# Altium schematic sheet sensors.SchDoc
size A4; SheetNumber: 4; SheetTotal: 9
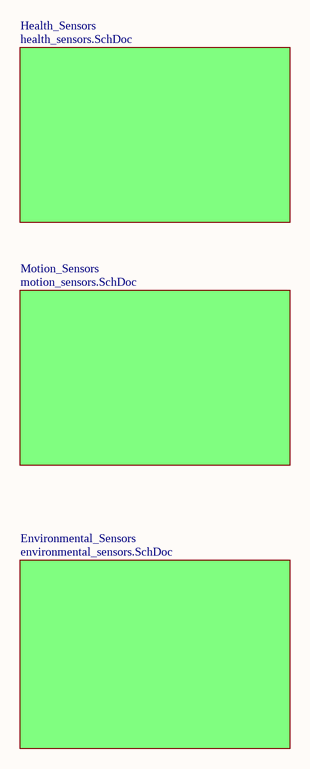
[diagram p0: sensors.SchDoc]

## Sub-sheets
Environmental_Sensors = environmental_sensors.SchDoc: no entries
Health_Sensors = health_sensors.SchDoc: no entries
Motion_Sensors = motion_sensors.SchDoc: no entries